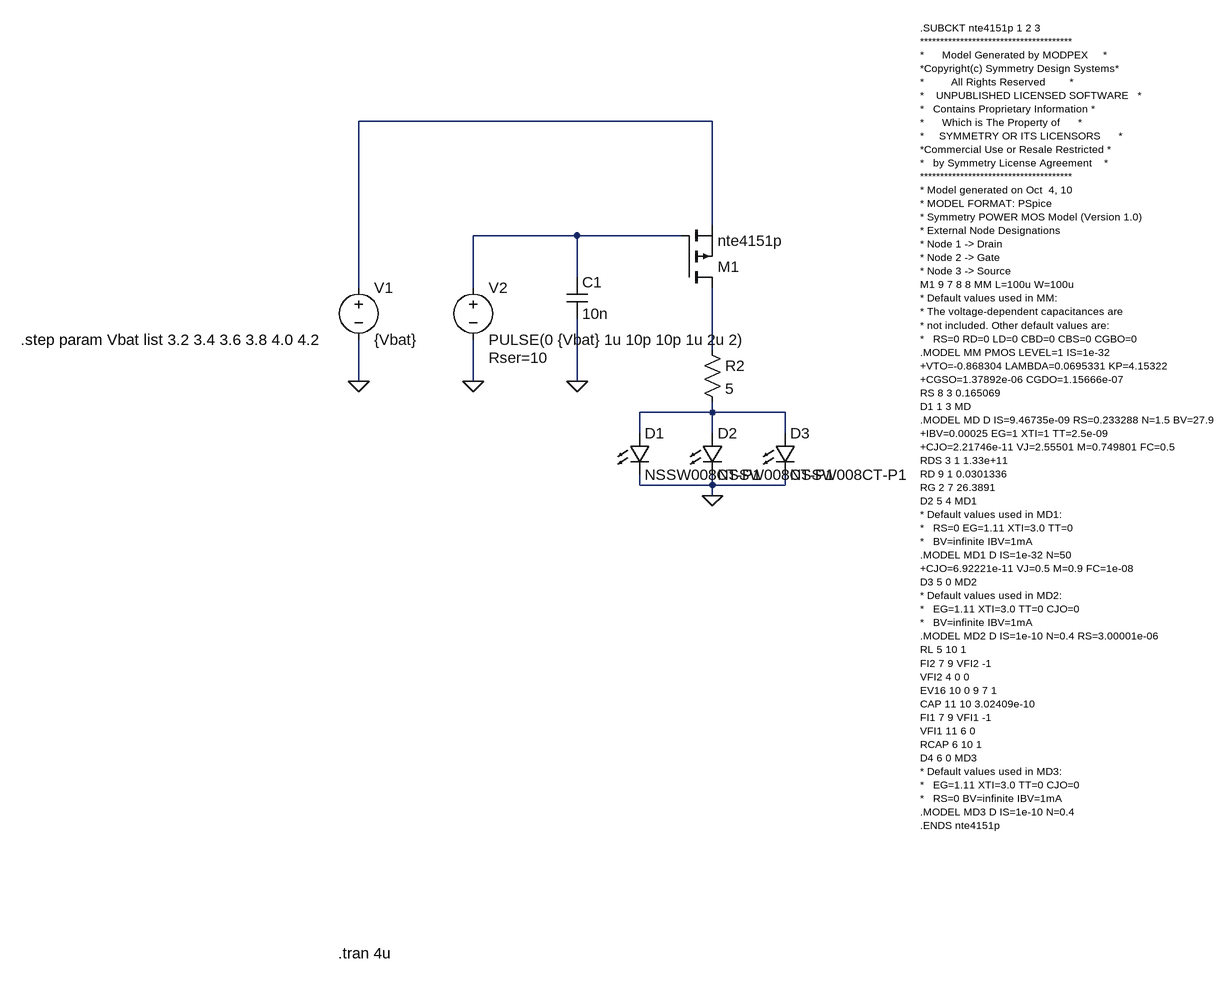
[diagram p0: schematic sim.asc]
sim.asc, the LTspice schematic file:
Version 4
SHEET 1 1208 1748
WIRE -320 -64 -864 -64
WIRE -320 96 -320 -64
WIRE -528 112 -688 112
WIRE -368 112 -528 112
WIRE -528 176 -528 112
WIRE -864 192 -864 -64
WIRE -688 192 -688 112
WIRE -320 288 -320 192
WIRE -864 336 -864 272
WIRE -688 336 -688 272
WIRE -528 336 -528 240
WIRE -320 384 -320 368
WIRE -320 384 -432 384
WIRE -208 384 -320 384
WIRE -432 416 -432 384
WIRE -320 416 -320 384
WIRE -208 416 -208 384
WIRE -432 496 -432 480
WIRE -320 496 -320 480
WIRE -320 496 -432 496
WIRE -208 496 -208 480
WIRE -208 496 -320 496
WIRE -320 512 -320 496
FLAG -320 512 0
FLAG -864 336 0
FLAG -688 336 0
FLAG -528 336 0
SYMBOL pmos -368 192 M180
SYMATTR InstName M1
SYMATTR Value nte4151p
SYMATTR Prefix X
SYMBOL voltage -864 176 R0
WINDOW 123 0 0 Left 2
WINDOW 39 0 0 Left 2
SYMATTR InstName V1
SYMATTR Value {Vbat}
SYMBOL voltage -688 176 R0
WINDOW 123 0 0 Left 2
WINDOW 39 24 124 Left 2
SYMATTR SpiceLine Rser=10
SYMATTR InstName V2
SYMATTR Value PULSE(0 {Vbat} 1u 10p 10p 1u 2u 2)
SYMBOL LED -448 416 R0
SYMATTR InstName D1
SYMATTR Value NSSW008CT-P1
SYMBOL LED -336 416 R0
SYMATTR InstName D2
SYMATTR Value NSSW008CT-P1
SYMBOL LED -224 416 R0
SYMATTR InstName D3
SYMATTR Value NSSW008CT-P1
SYMBOL cap -544 176 R0
SYMATTR InstName C1
SYMATTR Value 10n
SYMBOL res -336 272 R0
SYMATTR InstName R2
SYMATTR Value 5
TEXT 0 -208 Left 1 !.SUBCKT nte4151p 1 2 3\n**************************************\n*      Model Generated by MODPEX     *\n*Copyright(c) Symmetry Design Systems*\n*         All Rights Reserved        *\n*    UNPUBLISHED LICENSED SOFTWARE   *\n*   Contains Proprietary Information *\n*      Which is The Property of      *\n*     SYMMETRY OR ITS LICENSORS      *\n*Commercial Use or Resale Restricted *\n*   by Symmetry License Agreement    *\n**************************************\n* Model generated on Oct  4, 10\n* MODEL FORMAT: PSpice\n* Symmetry POWER MOS Model (Version 1.0)\n* External Node Designations\n* Node 1 -> Drain\n* Node 2 -> Gate\n* Node 3 -> Source\nM1 9 7 8 8 MM L=100u W=100u\n* Default values used in MM:\n* The voltage-dependent capacitances are\n* not included. Other default values are:\n*   RS=0 RD=0 LD=0 CBD=0 CBS=0 CGBO=0\n.MODEL MM PMOS LEVEL=1 IS=1e-32\n+VTO=-0.868304 LAMBDA=0.0695331 KP=4.15322\n+CGSO=1.37892e-06 CGDO=1.15666e-07\nRS 8 3 0.165069\nD1 1 3 MD\n.MODEL MD D IS=9.46735e-09 RS=0.233288 N=1.5 BV=27.9\n+IBV=0.00025 EG=1 XTI=1 TT=2.5e-09\n+CJO=2.21746e-11 VJ=2.55501 M=0.749801 FC=0.5\nRDS 3 1 1.33e+11\nRD 9 1 0.0301336\nRG 2 7 26.3891\nD2 5 4 MD1\n* Default values used in MD1:\n*   RS=0 EG=1.11 XTI=3.0 TT=0\n*   BV=infinite IBV=1mA\n.MODEL MD1 D IS=1e-32 N=50\n+CJO=6.92221e-11 VJ=0.5 M=0.9 FC=1e-08\nD3 5 0 MD2\n* Default values used in MD2:\n*   EG=1.11 XTI=3.0 TT=0 CJO=0\n*   BV=infinite IBV=1mA\n.MODEL MD2 D IS=1e-10 N=0.4 RS=3.00001e-06\nRL 5 10 1\nFI2 7 9 VFI2 -1\nVFI2 4 0 0\nEV16 10 0 9 7 1\nCAP 11 10 3.02409e-10\nFI1 7 9 VFI1 -1\nVFI1 11 6 0\nRCAP 6 10 1\nD4 6 0 MD3\n* Default values used in MD3:\n*   EG=1.11 XTI=3.0 TT=0 CJO=0\n*   RS=0 BV=infinite IBV=1mA\n.MODEL MD3 D IS=1e-10 N=0.4\n.ENDS nte4151p
TEXT -896 1216 Left 2 !.tran 4u
TEXT -1384 272 Left 2 !.step param Vbat list 3.2 3.4 3.6 3.8 4.0 4.2

The netlist it stands for:
* sim.asc
XM1 N003 N002 N001 nte4151p  ; pins D G S
V1 N001 0 {Vbat}
V2 N002 0 PULSE(0 {Vbat} 1u 10p 10p 1u 2u 2) Rser=10
D1 N004 0 NSSW008CT-P1
D2 N004 0 NSSW008CT-P1
D3 N004 0 NSSW008CT-P1
C1 N002 0 10n
R2 N003 N004 5
.model D D
.lib standard.dio
.SUBCKT nte4151p 1 2 3
**************************************
*      Model Generated by MODPEX     *
*Copyright(c) Symmetry Design Systems*
*         All Rights Reserved        *
*    UNPUBLISHED LICENSED SOFTWARE   *
*   Contains Proprietary Information *
*      Which is The Property of      *
*     SYMMETRY OR ITS LICENSORS      *
*Commercial Use or Resale Restricted *
*   by Symmetry License Agreement    *
**************************************
* Model generated on Oct  4, 10
* MODEL FORMAT: PSpice
* Symmetry POWER MOS Model (Version 1.0)
* External Node Designations
* Node 1 -> Drain
* Node 2 -> Gate
* Node 3 -> Source
M1 9 7 8 8 MM L=100u W=100u
* Default values used in MM:
* The voltage-dependent capacitances are
* not included. Other default values are:
*   RS=0 RD=0 LD=0 CBD=0 CBS=0 CGBO=0
.MODEL MM PMOS LEVEL=1 IS=1e-32
+VTO=-0.868304 LAMBDA=0.0695331 KP=4.15322
+CGSO=1.37892e-06 CGDO=1.15666e-07
RS 8 3 0.165069
D1 1 3 MD
.MODEL MD D IS=9.46735e-09 RS=0.233288 N=1.5 BV=27.9
+IBV=0.00025 EG=1 XTI=1 TT=2.5e-09
+CJO=2.21746e-11 VJ=2.55501 M=0.749801 FC=0.5
RDS 3 1 1.33e+11
RD 9 1 0.0301336
RG 2 7 26.3891
D2 5 4 MD1
* Default values used in MD1:
*   RS=0 EG=1.11 XTI=3.0 TT=0
*   BV=infinite IBV=1mA
.MODEL MD1 D IS=1e-32 N=50
+CJO=6.92221e-11 VJ=0.5 M=0.9 FC=1e-08
D3 5 0 MD2
* Default values used in MD2:
*   EG=1.11 XTI=3.0 TT=0 CJO=0
*   BV=infinite IBV=1mA
.MODEL MD2 D IS=1e-10 N=0.4 RS=3.00001e-06
RL 5 10 1
FI2 7 9 VFI2 -1
VFI2 4 0 0
EV16 10 0 9 7 1
CAP 11 10 3.02409e-10
FI1 7 9 VFI1 -1
VFI1 11 6 0
RCAP 6 10 1
D4 6 0 MD3
* Default values used in MD3:
*   EG=1.11 XTI=3.0 TT=0 CJO=0
*   RS=0 BV=infinite IBV=1mA
.MODEL MD3 D IS=1e-10 N=0.4
.ENDS nte4151p
.tran 4u
.step param Vbat list 3.2 3.4 3.6 3.8 4.0 4.2
.backanno
.end